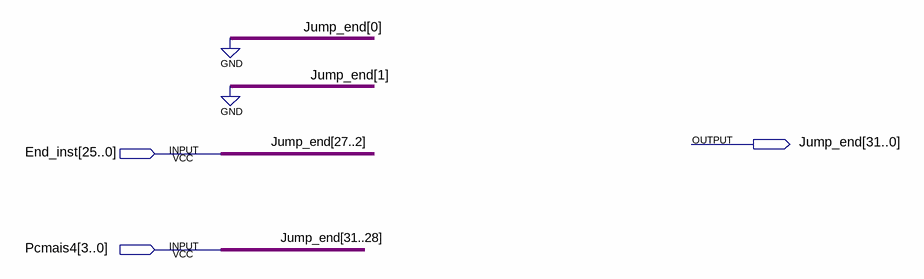
[diagram p0: schematic sheet]
// Quartus schematic Endereco_jump.bdf as structural Verilog: 0 symbols, 3 pins
module Endereco_jump (
  input  [25:0] End_inst,
  input  [3:0] Pcmais4,
  output [31:0] Jump_end
);


  assign Jump_end = {Pcmais4, End_inst, 2'b00};
endmodule
